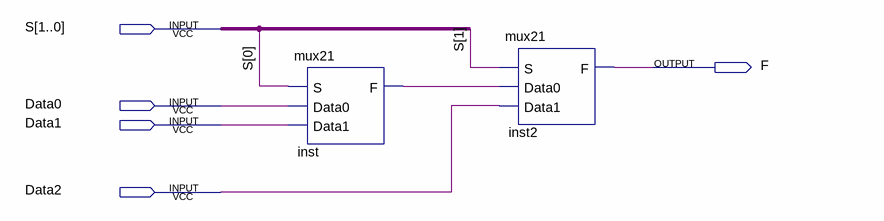
[diagram p0: schematic sheet]
// Quartus schematic mux31.bdf as structural Verilog: 2 symbols, 5 pins
module mux31 (
  input  [1:0] S,
  input  Data0,
  input  Data1,
  input  Data2,
  output F
);

  wire inst_f;

  mux21 inst (.S(S[0]), .Data0(Data0), .Data1(Data1), .F(inst_f));
  mux21 inst2 (.S(S[1]), .Data0(inst_f), .Data1(Data2), .F(F));
endmodule
